# EAGLE design TriDrone_2012 (EAGLE 6.2)
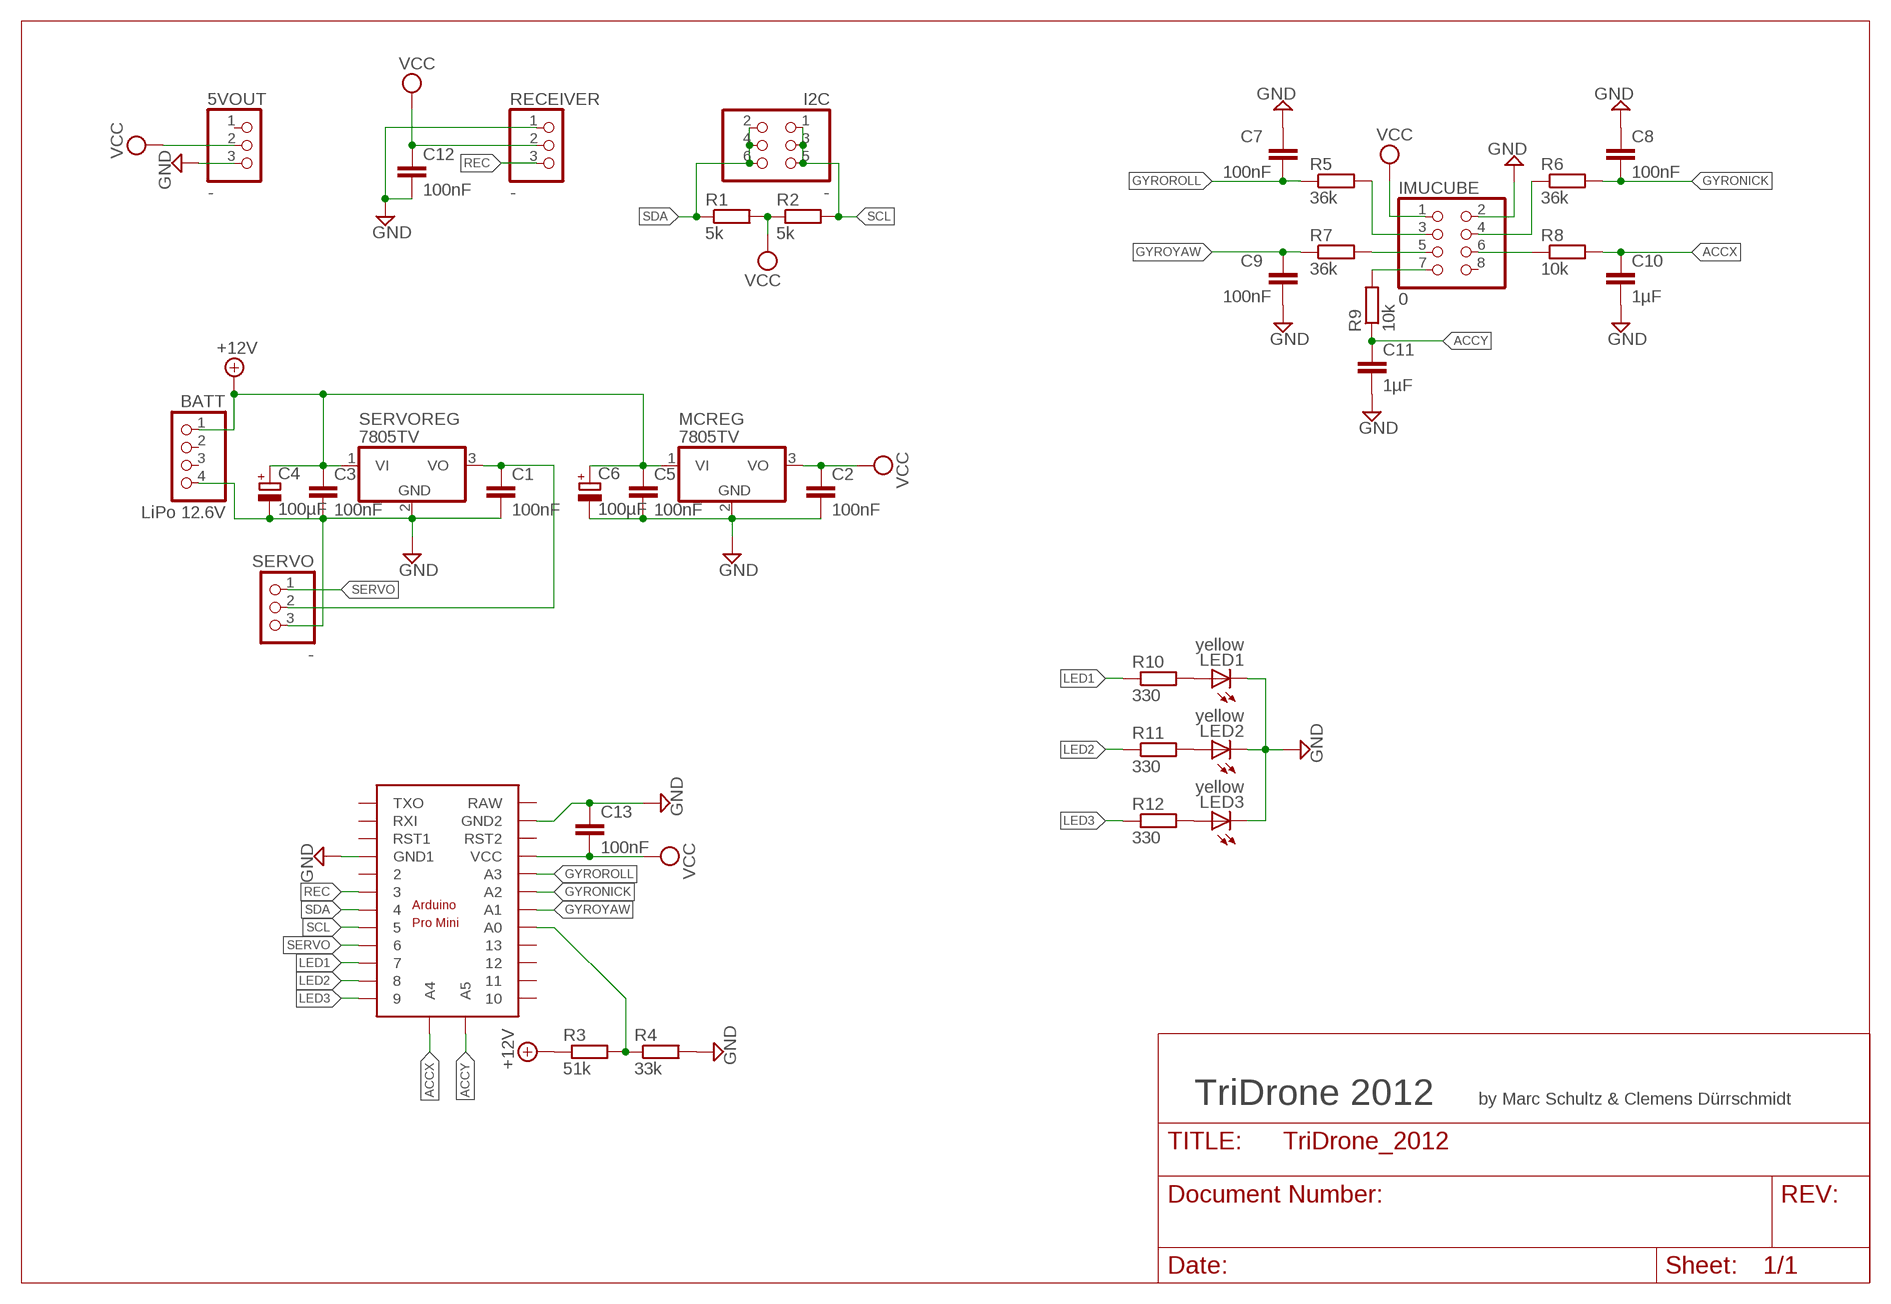
[diagram p0: schematic, sheet 1]

## Parts
5VOUT  -  PINHD-1X3  [1X03]
BATT  LiPo 12.6V  PINHD-1X4/90  [1X04/90]
C1  100nF  C-EU025-025X050  [C025-025X050]
C2  100nF  C-EU025-025X050  [C025-025X050]
C3  100nF  C-EU025-025X050  [C025-025X050]
C4  100µF  CPOL-EUE2.5-7  [E2,5-7]
C5  100nF  C-EU025-025X050  [C025-025X050]
C6  100µF  CPOL-EUE2.5-7  [E2,5-7]
C7  100nF  C-EU025-025X050  [C025-025X050]
C8  100nF  C-EU025-025X050  [C025-025X050]
C9  100nF  C-EU025-025X050  [C025-025X050]
C10  1µF  C-EU025-025X050  [C025-025X050]
C11  1µF  C-EU025-025X050  [C025-025X050]
C12  100nF  C-EU025-025X050  [C025-025X050]
C13  100nF  C-EU025-025X050  [C025-025X050]
I2C  -  PINHD-2X3/90  [2X03/90]
IMUCUBE  0  PINHD-2X4  [2X04]
LED1  yellow  LED3MM  [LED3MM]
LED2  yellow  LED3MM  [LED3MM]
LED3  yellow  LED3MM  [LED3MM]
MCREG  7805TV  [TO220V]
R1  5k  R-EU_0204/7  [0204/7]
R2  5k  R-EU_0204/7  [0204/7]
R3  51k  R-EU_0204/7  [0204/7]
R4  33k  R-EU_0204/7  [0204/7]
R5  36k  R-EU_0204/7  [0204/7]
R6  36k  R-EU_0204/7  [0204/7]
R7  36k  R-EU_0204/7  [0204/7]
R8  10k  R-EU_0204/7  [0204/7]
R9  10k  R-EU_0204/7  [0204/7]
R10  330  R-EU_0204/7  [0204/7]
R11  330  R-EU_0204/7  [0204/7]
R12  330  R-EU_0204/7  [0204/7]
RECEIVER  -  PINHD-1X3  [1X03]
SERVO  -  PINHD-1X3  [1X03]
SERVOREG  7805TV  [TO220V]
U$2  ARDUINO_PRO_MINI  [ARDUINO_PRO_MINI]

## Nets
+12V: BATT.1 C3.1 C4.+ C5.1 C6.+ MCREG.1(VI) R3.1 SERVOREG.1(VI)
ACCX: C10.1 R8.2 U$2.A4
ACCY: C11.1 R9.1 U$2.A5
GND: 5VOUT.3 BATT.4 C1.2 C2.2 C3.2 C4.- C5.2 C6.- C7.1 C8.1 C9.2 C10.2 C11.2 C12.2 C13.1 IMUCUBE.2 LED1.K(C) LED2.K(C) LED3.K(C) MCREG.2(GND) R4.2 RECEIVER.1 SERVO.3 SERVOREG.2(GND) U$2.GND1 U$2.GND2
GYRONICK: C8.2 R6.2 U$2.A2
GYROROLL: C7.2 R5.1 U$2.A3
GYROYAW: C9.1 R7.1 U$2.A1
LED1: R10.1 U$2.7
LED2: R11.1 U$2.8
LED3: R12.1 U$2.9
N$5: IMUCUBE.3 R5.2
N$6: C1.1 SERVO.2 SERVOREG.3(VO)
N$10: IMUCUBE.4 R6.1
N$14: R3.2 R4.1 U$2.A0
N$17: IMUCUBE.6 R8.1
N$18: IMUCUBE.5 R7.2
N$20: IMUCUBE.7 R9.2
N$23: LED1.A R10.2
N$24: LED2.A R11.2
N$25: LED3.A R12.2
REC: RECEIVER.3 U$2.3
SCL: I2C.1 I2C.3 I2C.5 R2.2 U$2.5
SDA: I2C.2 I2C.4 I2C.6 R1.1 U$2.4
SERVO: SERVO.1 U$2.6
VCC: 5VOUT.2 C2.1 C12.1 C13.2 IMUCUBE.1 MCREG.3(VO) R1.2 R2.1 RECEIVER.2 U$2.VCC
Unconnected: 5VOUT.1 BATT.2 BATT.3 IMUCUBE.8 U$2.2 U$2.10 U$2.11 U$2.12 U$2.13 U$2.RAW U$2.RST1 U$2.RST2 U$2.RXI U$2.TXO

## Notes on the sheet
- TriDrone 2012 | by Marc Schultz & Clemens Dürrschmidt

## Library data of the parts
5VOUT RECEIVER SERVO = pinhead:PINHD-1X3: PIN HEADER
BATT = pinhead:PINHD-1X4: PIN HEADER
C1-C3 C5 C7-C13 = rcl:C-EU: CAPACITOR, European symbol
C4 C6 = rcl:CPOL-EU: POLARIZED CAPACITOR, European symbol
I2C = pinhead:PINHD-2X3: PIN HEADER
IMUCUBE = pinhead:PINHD-2X4: PIN HEADER
LED1-LED3 = led:LED: LED OSRAM: - CHIPLED LG R971, LG N971, LY N971, LG Q971, LY Q971, LO R971, LY R971 LH N974, LH R974 LS Q976, LO Q976, LY Q976 LO Q996 - Hyper CHIPLED LW Q18S LB Q993, LB Q99A, LB R99A - SideLED LS A670, LO A670, LY A670, LG A670, LP A670 LB A673, LV A673, LT A673, LW A673 LH A674 LY A675 LS A676, LA A676, LO A676, LY A676, LW A676 LS A679, LY A679, LG A679 - Hyper Micro SIDELED® LS Y876, LA Y876, LO Y876, LY Y876 LT Y87S - SmartLED LW L88C, LW L88S LB L89C, LB L89S, LG L890 LS L89K, LO L89K, LY L89K LS L896, LA L896, LO L896, LY L896 - TOPLED LS T670, LO T670, LY T670, LG T670, LP T670 LSG T670, LSP T670, LSY T670, LOP T670, LYG T670 LG T671, LOG T671, LSG T671 LB T673, LV T673, LT T673, LW T673 LH T674 LS T676, LA T676, LO T676, LY T676, LB T676, LH T676, LSB T676, LW T676 LB T67C, LV T67C, LT T67C, LS T67K, LO T67K, LY T67K, LW E67C LS E67B, LA E67B, LO E67B, LY E67B, LB E67C, LV E67C, LT E67C LW T67C LS T679, LY T679, LG T679 LS T770, LO T770, LY T770, LG T770, LP T770 LB T773, LV T773, LT T773, LW T773 LH T774 LS E675, LA E675, LY E675, LS T675 LS T776, LA T776, LO T776, LY T776, LB T776 LHGB T686 LT T68C, LB T68C - Hyper Mini TOPLED® LB M676 - Mini TOPLED Santana® LG M470 LS M47K, LO M47K, LY M47K Source: http://www.osram.convergy.de LUXEON: - LUMILED® LXK2-PW12-R00, LXK2-PW12-S00, LXK2-PW14-U00, LXK2-PW14-V00 LXK2-PM12-R00, LXK2-PM12-S00, LXK2-PM14-U00 LXK2-PE12-Q00, LXK2-PE12-R00, LXK2-PE12-S00, LXK2-PE14-T00, LXK2-PE14-U00 LXK2-PB12-K00, LXK2-PB12-L00, LXK2-PB12-M00, LXK2-PB14-N00, LXK2-PB14-P00, LXK2-PB14-Q00 LXK2-PR12-L00, LXK2-PR12-M00, LXK2-PR14-Q00, LXK2-PR14-R00 LXK2-PD12-Q00, LXK2-PD12-R00, LXK2-PD12-S00 LXK2-PH12-R00, LXK2-PH12-S00 LXK2-PL12-P00, LXK2-PL12-Q00, LXK2-PL12-R00 Source: www.luxeon.com KINGBRIGHT: KA-3528ASYC Source: www.kingbright.com
MCREG SERVOREG = linear:78*: Positive VOLTAGE REGULATOR Source: http://cache.national.com/ds/LM/LM78L05.pdf http://www.fairchildsemi.com/ds/LM/LM7805.pdf
R1-R12 = resistor:R-EU_: RESISTOR, European symbol
U$2 = TriDrone:ARDUINO_PRO_MINI

## Board
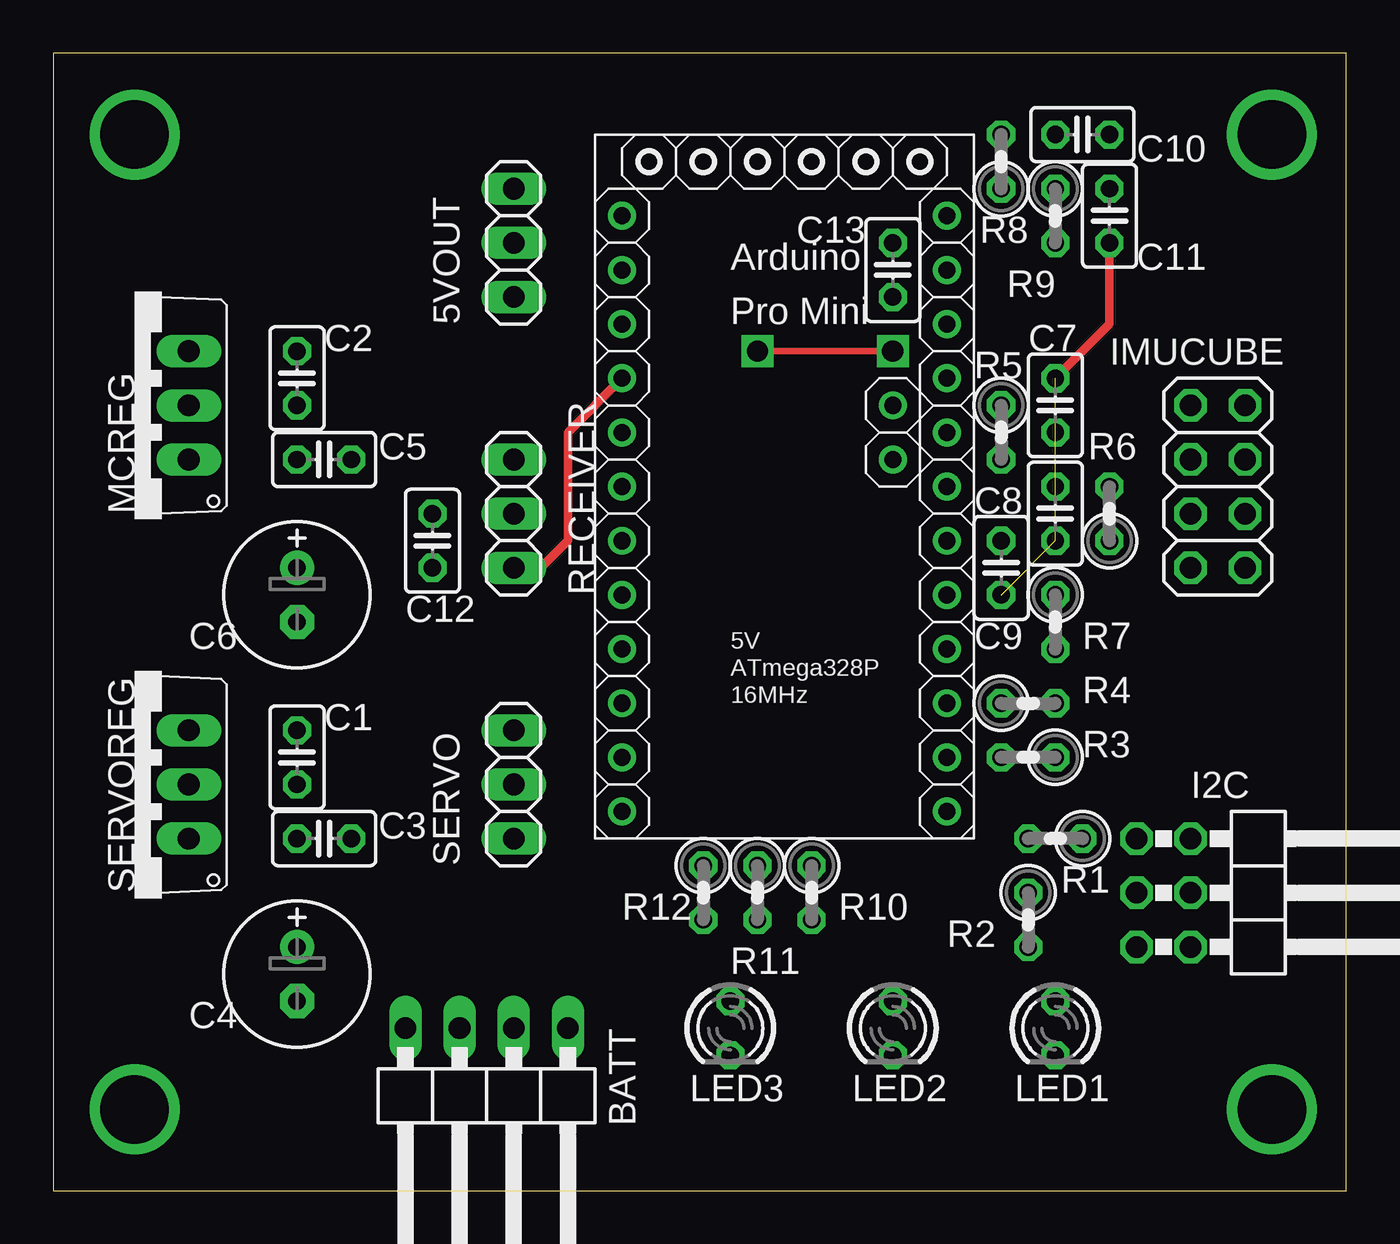
[diagram p1: board, top side]
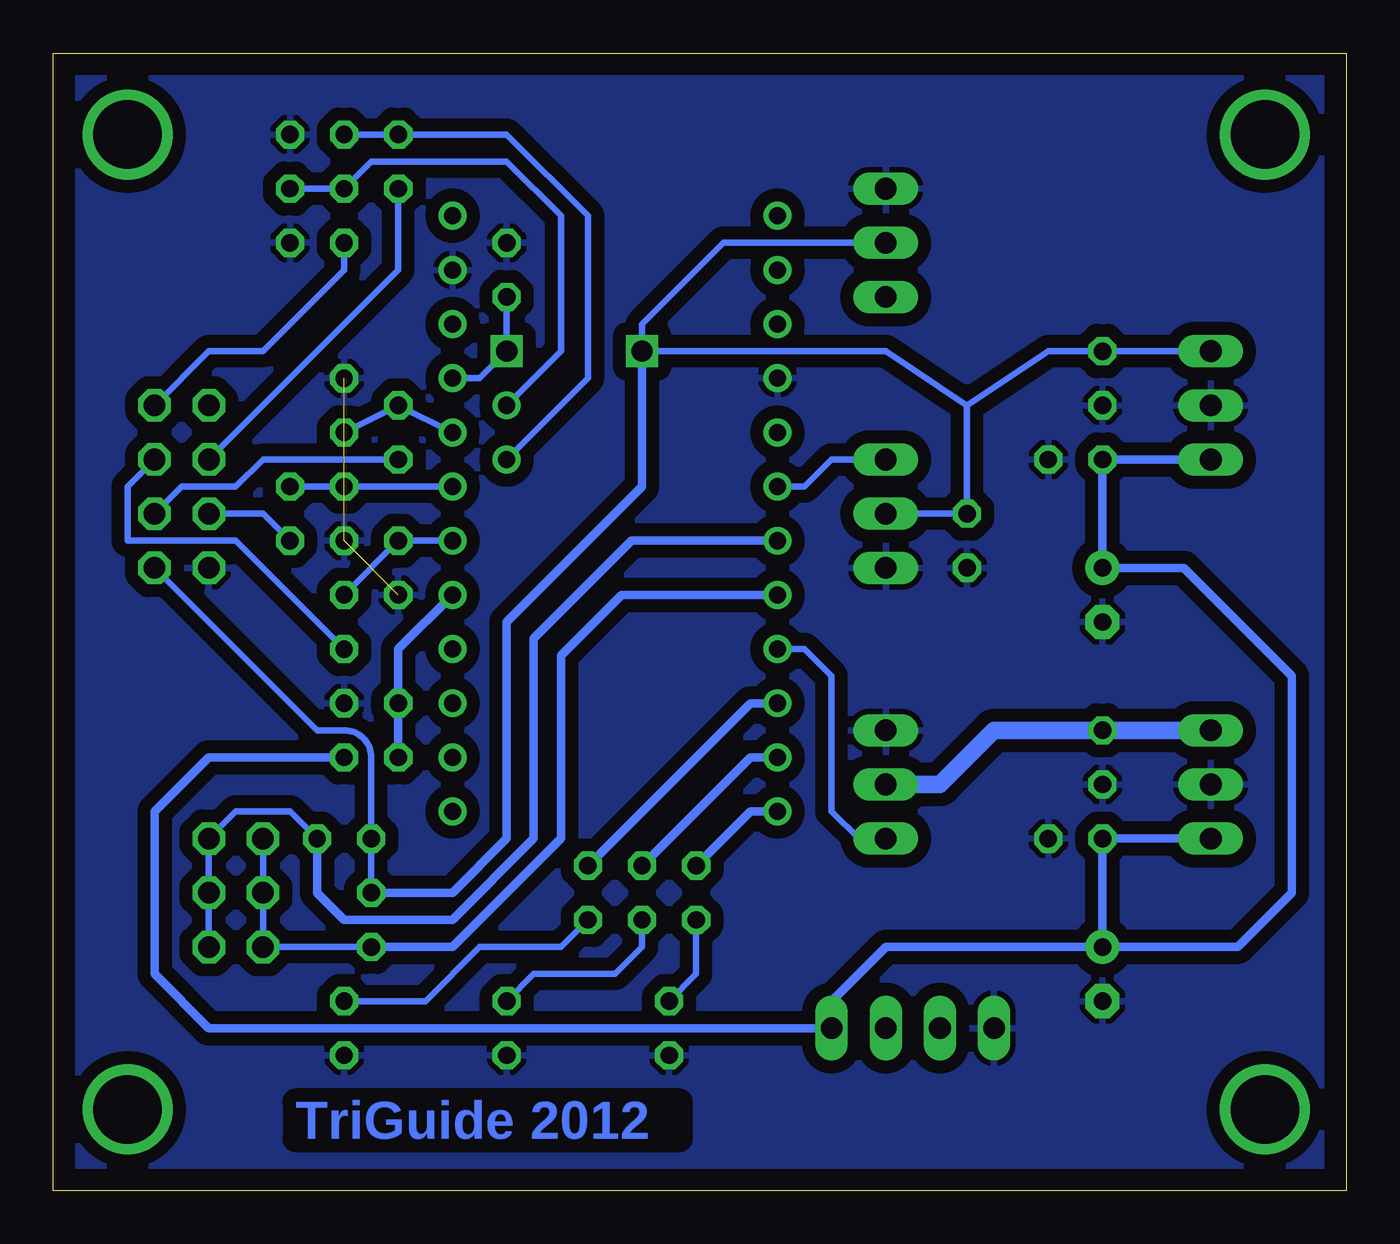
[diagram p2: board, bottom side, seen from below]

Size 60.63 x 53.34 mm. Coordinates in mm from the lower left corner, seen from the top.
Outline: 0,0 60.63,0 60.63,53.34 0,53.34 0,0
Copper layers (1*16): Top 0.035mm / dielectric 1.5mm / Bottom 0.035mm
Design rules: minimum track width 10mil, minimum drill 24mil, track to track 12mil, track to pad 12mil, pad to pad 12mil, via to via 12mil, smd to smd 8mil, copper to edge 40mil, drill to drill 8mil, minimum pad ring 10mil, minimum via ring 8mil, stop-mask expansion 4mil, vias tented up to drill 0mil, thermal gap 10mil

### Footprints (pad centres in the part's own frame; a part is rotated, then mirrored left to right if it is on the bottom)
1X03 = drill 1.016 long: 1 -2.54,0; 2 0,0; 3 2.54,0
1X04/90 = drill 1.016 long: 1 -3.81,-3.81; 2 -1.27,-3.81; 3 1.27,-3.81; 4 3.81,-3.81
C025-025X050 = drill 0.813 octagon: 1 -1.27,0; 2 1.27,0
E2,5-7 = drill 0.813 pad 1.6: + -1.27,0 | drill 0.813 pad 1.6 octagon: - 1.27,0
2X03/90 = drill 1.016 octagon: 1 -2.54,-6.35; 2 -2.54,-3.81; 3 0,-6.35; 4 0,-3.81; 5 2.54,-6.35; 6 2.54,-3.81
2X04 = drill 1.016 octagon: 1 -3.81,-1.27; 2 -3.81,1.27; 3 -1.27,-1.27; 4 -1.27,1.27; 5 1.27,-1.27; 6 1.27,1.27; 7 3.81,-1.27; 8 3.81,1.27
LED3MM = drill 0.813 octagon: A -1.27,0; K 1.27,0
TO220V = drill 1.016 long: 1 -2.54,-2.54; 2 0,-2.54; 3 2.54,-2.54
0207/2V = drill 0.813 octagon: 1 -1.27,0; 2 1.27,0
ARDUINO_PRO_MINI = drill 0.8: 2 -7.62,2.54; 3 -7.62,0; 4 -7.62,-2.54; 5 -7.62,-5.08; 6 -7.62,-7.62; 7 -7.62,-10.16; 8 -7.62,-12.7; 9 -7.62,-15.24; 10 7.62,-15.24; 11 7.62,-12.7; 12 7.62,-10.16; 13 7.62,-7.62; A0 7.62,-5.08; A1 7.62,-2.54; A2 7.62,0; A3 7.62,2.54; A4 5.08,1.27; A5 5.08,3.81; GND1 -7.62,5.08; GND2 7.62,10.16; RAW 7.62,12.7; RST1 -7.62,7.62; RST2 7.62,7.62; RXI -7.62,10.16; TXO -7.62,12.7; VCC 7.62,5.08

### Placement (x,y rotation side)
5VOUT  21.59,44.45 90 top
BATT  20.32,3.81 180 top
C1  11.43,20.32 270 top
C2  11.43,38.1 270 top
C3  12.7,16.51 0 top
C4  11.43,10.16 270 top
C5  12.7,34.29 0 top
C6  11.43,27.94 270 top
C7  46.99,36.83 270 top
C8  46.99,31.75 90 top
C9  44.45,29.21 270 top
C10  48.26,49.53 0 top
C11  49.53,45.72 270 top
C12  17.78,30.48 270 top
C13  39.37,43.18 270 top
I2C  57.15,13.97 270 top
IMUCUBE  54.61,33.02 90 top
LED1  46.99,7.62 270 top
LED2  39.37,7.62 270 top
LED3  31.75,7.62 270 top
MCREG  3.81,36.83 90 top
R1  5k  [0207/2V]  46.99,16.51 180 top
R2  5k  [0207/2V]  45.72,12.7 270 top
R3  51k  [0207/2V]  45.72,20.32 180 top
R4  33k  [0207/2V]  45.72,22.86 0 top
R5  36k  [0207/2V]  44.45,35.56 270 top
R6  36k  [0207/2V]  49.53,31.75 90 top
R7  36k  [0207/2V]  46.99,26.67 270 top
R8  10k  [0207/2V]  44.45,48.26 90 top
R9  10k  [0207/2V]  46.99,45.72 270 top
R10  330  [0207/2V]  35.56,13.97 270 top
R11  330  [0207/2V]  33.02,13.97 270 top
R12  330  [0207/2V]  30.48,13.97 270 top
RECEIVER  21.59,31.75 90 top
SERVO  21.59,19.05 90 top
SERVOREG  3.81,19.05 90 top
U$2  34.29,33.02 0 top

### Tracks (layer width: path | path; a pad name or v marks a point on that pad's centre or on a via)
+12V
  Bottom 0.406: SERVOREG.1 C3.1 C4.+ | MCREG.1 C5.1 C6.+ 7.62,29.21 2.54,24.13 2.54,13.97 5.08,11.43 C4.+ | R3.1 53.34,20.32 55.88,17.78 55.88,10.16 53.34,7.62 BATT.1 24.13,8.89 21.59,11.43 C4.+
ACCX
  Bottom 0.305: U$2.A4 35.56,38.1 35.56,45.72 39.37,49.53 R8.2 C10.1
ACCY
  Bottom 0.305: C11.1 R9.1 45.72,48.26 39.37,48.26 36.83,45.72 36.83,39.37 U$2.A5
GND  (2 unrouted)
  Top 0.406: C7.1 49.53,40.64 C11.2 | RECEIVER.1 22.86,29.21 24.13,30.48 24.13,35.56 U$2.GND1
  pour Bottom (isolate 0.61): 0,53.34 60.96,53.34 60.96,0 0,0
GYRONICK
  Bottom 0.305: U$2.A2 C8.2 R6.2
GYROROLL
  Bottom 0.305: U$2.A3 R5.1 C7.2
GYROYAW
  Bottom 0.305: U$2.A1 C9.1 R7.1
LED1
  Bottom 0.406: R10.1 27.94,22.86 U$2.7
LED2
  Bottom 0.406: U$2.8 27.94,20.32 R11.1
LED3
  Bottom 0.406: U$2.9 27.94,17.78 R12.1
N$1  (via drill 3.2)
  other vias: 57.15,3.81
N$2  (via drill 3.2)
  other vias: 3.81,3.81
N$3  (via drill 3.2)
  other vias: 3.81,49.53
N$4  (via drill 3.2)
  other vias: 57.15,49.53
N$5
  Bottom 0.305: IMUCUBE.3 54.61,33.02 52.07,33.02 50.8,34.29 R5.2
N$6
  Bottom 0.813: SERVOREG.3 C1.1 16.51,21.59 19.05,19.05 SERVO.2
N$10
  Bottom 0.305: R6.1 50.8,31.75 IMUCUBE.4
N$14
  Bottom 0.406: R3.2 R4.1 44.45,25.4 U$2.A0
N$17
  Bottom 0.305: IMUCUBE.6 44.45,43.18 R8.1
N$18
  Bottom 0.305: R7.2 52.07,30.48 57.15,30.48 57.15,33.02 IMUCUBE.5
N$20
  Bottom 0.305: R9.2 46.99,43.18 50.8,39.37 53.34,39.37 IMUCUBE.7
N$23
  Bottom 0.305: R10.2 36.83,11.43 40.64,11.43 43.18,8.89 LED1.A
N$24
  Bottom 0.305: R11.2 33.02,11.43 34.29,10.16 38.1,10.16 LED2.A
N$25
  Bottom 0.305: R12.2 30.48,10.16 LED3.A
REC
  Bottom 0.305: RECEIVER.3 24.13,34.29 25.4,33.02 U$2.3
SCL
  Bottom 0.305: I2C.1 I2C.3 I2C.5 R2.2
  Bottom 0.406: U$2.5 33.99,27.94 36.83,25.1 36.83,16.51 41.91,11.43 R2.2
SDA
  Bottom 0.305: R1.1 49.53,17.78 52.07,17.78 I2C.2 I2C.4 I2C.6
  Bottom 0.406: U$2.4 33.52,30.48 38.1,25.9 38.1,16.51 41.91,12.7 46.99,12.7 48.26,13.97 R1.1
SERVO
  Bottom 0.305: SERVO.1 22.86,16.51 24.13,17.78 24.13,24.13 25.4,25.4 U$2.6
VCC  (via drill 1)
  Top 0.305: v33.02,39.37 v39.37,39.37
  Bottom 0.305: R2.1 R1.2 45.72,20.32 arc-90 46.99,21.59 48.26,21.59 IMUCUBE.1 | MCREG.3 C2.1 13.97,39.37 17.78,36.83 | U$2.VCC 40.64,38.1 v39.37,39.37 C13.2 | RECEIVER.2 C12.1 17.78,36.83 | 17.78,36.83 21.59,39.37 v33.02,39.37 33.02,40.64 29.21,44.45 5VOUT.2
  Bottom 0.406: R2.1 41.91,13.97 39.37,16.51 39.37,26.67 33.02,33.02 v33.02,39.37

### Text on the board
Bottom: TriGuide 2012